# Altium project QuadCurrentLoopCape.PrjPCB
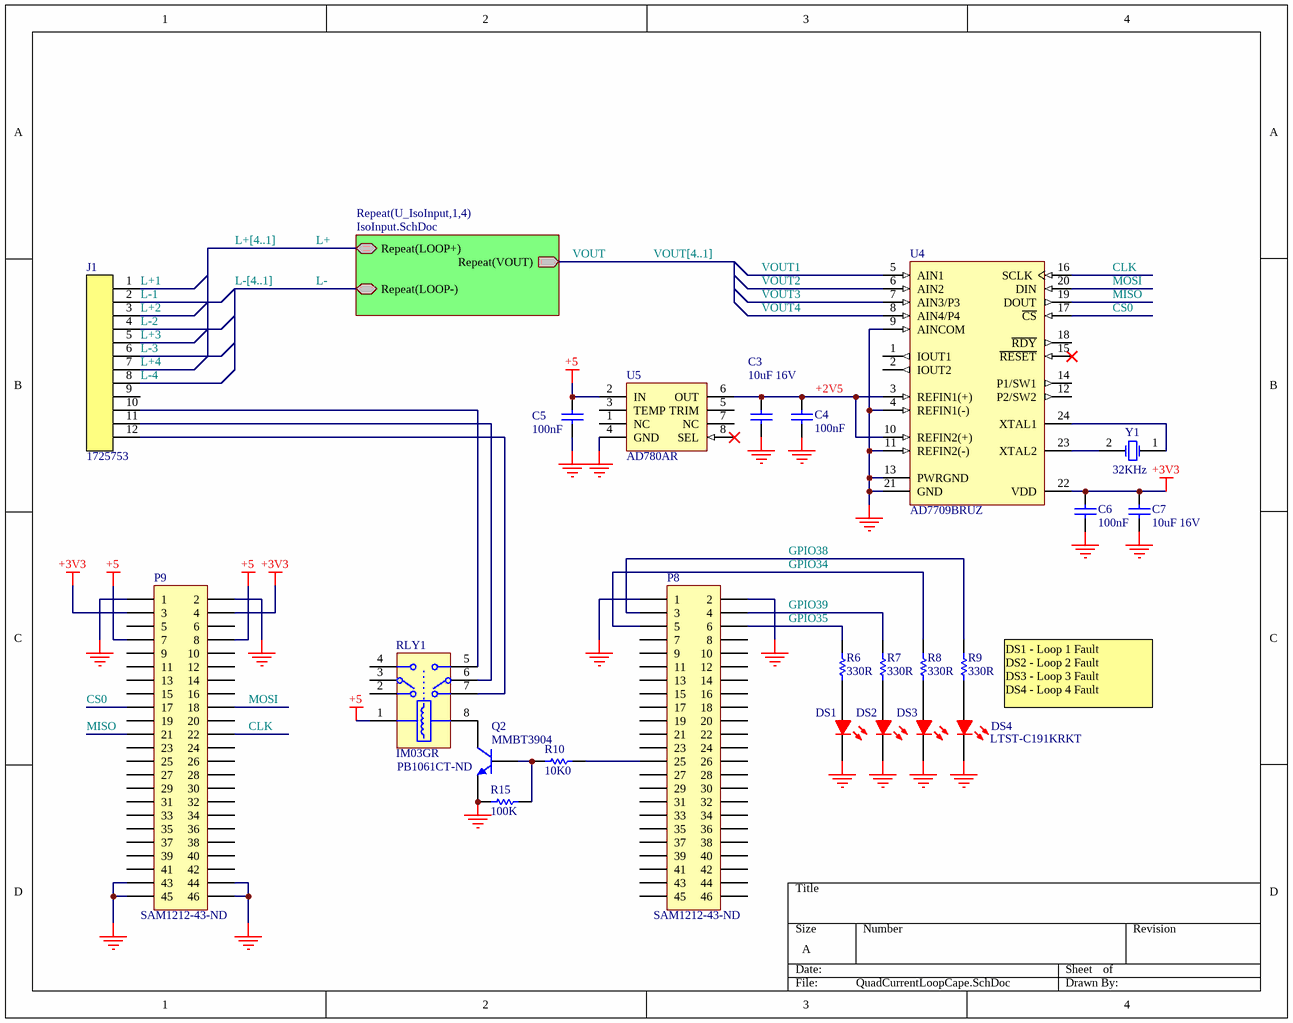
[diagram p0: QuadCurrentLoopCape.SchDoc]
2 sheets, 75 parts. Net scope: hierarchical (ports join the sheet entries above them; power ports are global).
Board file: QuadCurrentLoopCape.PcbDoc
Sheets:
  QuadCurrentLoopCape.SchDoc
    U_IsoInput1 = IsoInput.SchDoc
    U_IsoInput2 = IsoInput.SchDoc
    U_IsoInput3 = IsoInput.SchDoc
    U_IsoInput4 = IsoInput.SchDoc

## Sheet QuadCurrentLoopCape.SchDoc
size A

### Parts
C3  10uF 16V  [CAPC0805(2012)145_L]
C4  100nF  [CAPC0805(2012)100_M]
C5  100nF  [CAPC0805(2012)100_M]
C6  100nF  [CAPC0805(2012)100_M]
C7  10uF 16V  [CAPC0805(2012)145_L]
DS1  LTST-C191KRKT  [TOSH-0603LED_RED_V]  (value not drawn)
DS2  LTST-C191KRKT  [TOSH-0603LED_RED_V]  (value not drawn)
DS3  LTST-C191KRKT  [TOSH-0603LED_RED_V]  (value not drawn)
DS4  LTST-C191KRKT  [TOSH-0603LED_RED_V]
J1  1725753  [MPT0.5/12-2.54]
P8  Supplier Part Number 1: SAM1212-43-ND  [HDR2X23]  (hidden comment: Header 23X2)
P9  Supplier Part Number 1: SAM1212-43-ND  [HDR2X23]  (hidden comment: Header 23X2)
Q2  MMBT3904  [SOT23_N]
R6  value 330R  [RESC0805(2012)_L]  (hidden comment: 330R 1% 0805(2012))
R7  value 330R  [RESC0805(2012)_L]  (hidden comment: 330R 1% 0805(2012))
R8  value 330R  [RESC0805(2012)_L]  (hidden comment: 330R 1% 0805(2012))
R9  value 330R  [RESC0805(2012)_L]  (hidden comment: 330R 1% 0805(2012))
R10  10K0  [RESC0603(1608)_L]
R15  100K  [RESC0603(1608)_L]
RLY1  IM03GR  Supplier Part Number 1: PB1061CT-ND  [TECO-IM-8G-WING]
U4  AD7709BRUZ  [RU-24_L]
U5  AD780AR  [R-8C_L]
Y1  32KHz  [CMR200T]

### Sub-sheets
Repeat(U_IsoInput,1,4) = IsoInput.SchDoc: Repeat(LOOP+) (bidir), Repeat(LOOP-) (bidir), Repeat(VOUT) (out)

### Nets
+3V3: C6.2 C7.2 P9.3 P9.4 U4.22(VDD)
+5: C5.2 P9.7 P9.8 RLY1.1 U5.2(IN)
GND: C3.1 C4.1 C5.1 C6.1 C7.1 DS1.2(K) DS2.2(K) DS3.2(K) DS4.2(K) P8.1 P8.2 P9.1 P9.2 P9.43 P9.44 P9.45 P9.46 Q2.2(E) R15.2 U4.4(REFIN1(-)) U4.9(AINCOM) U4.11(REFIN2(-)) U4.13(PWRGND) U4.21(GND) U5.4(GND)
CLK: P9.22 U4.16(SCLK)
CS0: P9.17 U4.17(~{CS})
GPIO34: P8.5 R8.2
GPIO35: P8.6 R6.2
GPIO38: P8.3 R9.2
GPIO39: P8.4 R7.2
L+: sheet Repeat(U_IsoInput,1,4)/Repeat(LOOP+)
L+1: J1.1
L+2: J1.3
L+3: J1.5
L+4: J1.7
L-: sheet Repeat(U_IsoInput,1,4)/Repeat(LOOP-)
L-1: J1.2
L-2: J1.4
L-3: J1.6
L-4: J1.8
MISO: P9.21 U4.19(DOUT)
MOSI: P9.18 U4.20(DIN)
VOUT: sheet Repeat(U_IsoInput,1,4)/Repeat(VOUT)
VOUT1: U4.5(AIN1)
VOUT2: U4.6(AIN2)
VOUT3: U4.7(AIN3/P3)
VOUT4: U4.8(AIN4/P4)
NetC3_2: C3.2 C4.2 U4.3(REFIN1(+)) U4.10(REFIN2(+)) U5.6(OUT)
NetDS1_1: DS1.1(A) R6.1
NetDS2_1: DS2.1(A) R7.1
NetDS3_1: DS3.1(A) R8.1
NetDS4_1: DS4.1(A) R9.1
NetJ1_10: J1.10 RLY1.5
NetJ1_11: J1.11 RLY1.6
NetJ1_12: J1.12 RLY1.7
NetP8_25: P8.25 R10.2
NetQ2_1: Q2.1(B) R10.1 R15.1
NetQ2_3: Q2.3(C) RLY1.8
NetU4_23: U4.23(XTAL2) Y1.2(OSC2)
NetU4_24: U4.24(XTAL1) Y1.1(OSC1)

Not connected (* = marked no-connect by the designer): J1 9; P8 7 8 9 10 11 12 13 14 15 16 17 18 19 20 21 22 23 24 26 27 28 29 30 31 32 33 34 35 36 37 38 39 40 41 42 43 44 45 46; P9 5 6 9 10 11 12 13 14 15 16 19 20 23 24 25 26 27 28 29 30 31 32 33 34 35 36 37 38 39 40 41 42; RLY1 2 3 4; U4 1(IOUT1) 2(IOUT2) 12(P2/SW2) 14(P1/SW1) 15(~{RESET})* 18(~{RDY}); U5 1(NC) 3(TEMP) 5(TRIM) 7(NC) 8(SEL)*

### Buses and harness runs
bus L+[4..1]
bus L-[4..1]
bus VOUT[4..1]

### Notes on the sheet
- (near C4) +2V5
- DS1 - Loop 1 Fault
  DS2 - Loop 2 Fault
  DS3 - Loop 3 Fault
  DS4 - Loop 4 Fault

### Library data of the parts
C3 C7 = CMP-1036-04929-1: CAP 10uF 16V ±20% 0805 (2012 Metric) Thickness 1.45mm SMD; Case-EIA: 0805; Case-Metric: 2012; Value: 10uF 16V; Tolerance: ±20%; Rated Voltage: 16 V; Technology: SMT; Max Thickness: 1.45 mm; Supplier 1: Digi-Key; Supplier Part Number 1: 1276-2872-1-ND
C4-C6 = CMP-1036-04420-1: CAP 100nF 50V ±10% 0805 (2012 Metric) Thickness 1mm SMD; Case-EIA: 0805; Case-Metric: 2012; Rated Voltage: 50 V; Value: 100nF; Tolerance: ±10%; Max Thickness: 1 mm; Technology: SMT; Supplier 1: Digi-Key; Supplier Part Number 1: 399-1170-1-ND
DS1-DS4 = CMP-0444-00001-1: LED, Red 0603 (1608) 63mCd; Manufacturer: Toshiba; PartNumber: TLSU1008A(T04); Forward Current: 25 mA; Power Dissipation: 60 mW; Packing Type: Reel; Reverse Voltage: 4 V; Mounting Technology: Surface Mount; PackageDescription: 2-Pin SMT LED, 1.6 x 0.8 mm Pitch; ComponentLink1URL: http://www.toshiba-components.com/; ComponentLink1Description: Manufacturer URL; PackageReference: 0603LED_RED; ComponentLink2URL: http://www.semicon.toshiba.co.jp/info/docget.jsp?type=datasheet&lang=en&pid=TLSU1008A(T04); ComponentLink2Description: Datasheet; DatasheetVersion: Aug-08; Storage Temperature: -40 to 100 degC; Supplier 1: Digi-Key; Supplier Part Number 1: 160-1447-1-ND
J1 = Pheonix12: Supplier 1: Digi-Key; Supplier Part Number 1: 277-1283-ND
P8 P9 = Header 23X2: Header, 23-Pin, Dual Row; Supplier 1: Digi-Key
Q2 = MMBT3904: NPN Switching Transistor; AML Part Number: TRN-S0002; Published: 17-Sep-2003; LatestRevisionDate: 12-Dec-2006; LatestRevisionNote: IPC-7351 Footprint Added.; DatasheetVersion: 13-May-2002; PackageVersion: May-1999; PackageReference: SOT23; Publisher: Altium Limited; PackageDescription: 3-Pin SOT-23 Package 0.95 mm Pitch, 2.3 mm Lead Span; ComponentLink1Description: Manufacturer Link; ComponentLink1URL: http://www.semiconductors.philips.com/; ComponentLink2Description: Datasheet; ComponentLink2URL: http://www.semiconductors.philips.com/acrobat/datasheets/MMBT3904_4.pdf; Supplier 1: Digi-Key; Supplier Part Number 1: MMBT3904-FDICT-ND
R6-R9 = CMP-1013-00454-1: 330R 0.125W 1% 0805 (2012 Metric)  SMD; Case-EIA: 0805; Case-Metric: 2012; Power: 0.125 W; Tolerance: 1 %; Technology: SMT; Supplier 1: Digi-Key; Supplier Part Number 1: RHM330CHCT-ND
R10 = CMP-1012-00623-1: 10K 0.1W 1% 0603 (1608 Metric)  SMD; Value: 10000.00 Ohm; Case-EIA: 0603; Case-Metric: 1608; Power: 0.1 W; Tolerance: 1 %; Technology: SMT; Supplier Part Number 1: RHM330CHCT-ND; Supplier 1: Digi-Key
R15 = CMP-1012-00736-1: 100K 0.1W 1% 0603 (1608 Metric)  SMD; AML PArt Number: RES-S0242; Value: 100000.00 Ohm; Case-Metric: 1608; Case-EIA: 0603; Power: 0.1 W; Tolerance: 1 %; Technology: SMT; Supplier 1: Digi-Key; Supplier Part Number 1: 541-1825-1-ND
RLY1 = CMP-0439-00001-1: Low Power Consumption, High Dielectric, High Mechanical Shock Resistance, IM Relay; Manufacturer: TE Connectivity; Power Consumption: 140 mW; Contact Capacitance: 1 pF; Coil-contact Capacitance: 2 pF; Limiting Continuous Current: 2 A; ComponentLink1Description: Manufacturer URL; PackageReference: IM-8G-WING; Contact Material: PdRu +Au Covered; DatasheetVersion: Rev. 0411; ComponentLink2URL: http://www.te.com/commerce/DocumentDelivery/DDEController?Action=showdoc&DocId=Specification+Or+Standard%7F108-98001%7FS%7Fpdf%7FEnglish%7FENG_SS_108-98001_S.pdf%7F1-1462037-4; ComponentLink2Description: Datasheet; Mounting Technology: Surface Mount; Ambient Temperature: -40 to 85 degC; PartNumber: IM03GR; ComponentLink1URL: http://www.te.com/; PackageDescription: 8-Pin Relay, 10 x 6 mm Body, 0.95 mm Pitch; Supplier 1: Digi-Key
U4 = CMP-0313-01986-2: Quad 16-Bit Sigma-Delta Analog-to-Digital Converter with Serial, SPI Interface, 105SPS, -40 to +85 degC, RU-24, Pb-Free, Tube; Manufacturer: Analog Devices; Generic Part Number: AD7709; Interface: Ser, SPI; Resolution (Bits): 16; Throughput Rate (SPS): 105; Channels: 4; ComponentLink4Description: Product URL; Packing: Tube; DatasheetVersion: Rev.A; ComponentLink3Description: Package Specification; PackageReference: RU-24; PackageDescription: 24-Lead Thin Shrink Small Outline Package [TSSOP]; RoHS: Y; Code_JEDEC: MO-153-AD; ComponentLink1Description: Manufacturer URL; PackageVersion: 2002; ComponentLink2URL: http://www.analog.com/static/imported-files/data_sheets/AD7709.pdf; ComponentLink4URL: http://www.analog.com/en/analog-to-digital-converters/ad-converters/ad7709/products/product.html; PartNumber: AD7709BRUZ; ComponentLink2Description: Datasheet; ComponentLink3URL: http://www.analog.com/static/imported-files/packages/380523655245964505593671154107510036154RU24.pdf; Mounting Technology: Surface Mount; ComponentLink1URL: http://www.analog.com/en/index.html; Supplier 1: Digi-Key; Supplier Part Number 1: AD7709BRUZ-ND
U5 = AD780AR: 2.5V/3.0V Ultrahigh Precision Bandgap Voltage Reference; Note: Pins 1 and 7 are not connected; Published: 8-Jun-2000; LatestRevisionDate: 13-Apr-2006; LatestRevisionNote: IPC-7351 Footprint Added.; DatasheetVersion: REV. A; PackageVersion: revC; PackageReference: R-8C; Publisher: Altium Limited; PackageDescription: 8-Pin Small Outline Integrated Circuit 1.27 mm Pitch; Code_IPC: SOIC127P600-8; ComponentLink1Description: Manufacturer Link; ComponentLink1URL: http://www.analog.com/en/prod/0,,769_838_AD780%2C00.html; ComponentLink2Description: Datasheet; ComponentLink2URL: http://www.analog.com/UploadedFiles/Data_Sheets/87683462AD780_e.pdf; Supplier 1: Digi-Key; Supplier Part Number 1: AD780ARZ-ND
Y1 = XTAL: Crystal Oscillator; Published: 8-Jun-2000; LatestRevisionDate: 17-Jul-2002; LatestRevisionNote: Re-released for DXP Platform.; PackageReference: R38; Publisher: Altium Limited; PackageDescription: Crystal, Thru-Hole; 2 Leads; Body 3.1 x 8.2 mm (Dia.xH); Supplier 1: Digi-Key; Supplier Part Number 1: 535-9033-1-ND

## Sheet IsoInput.SchDoc
size A
Used 4 times, as channels U_IsoInput1, U_IsoInput2, U_IsoInput3, U_IsoInput4. Parts and nets are listed once, with the designators drawn on the sheet.
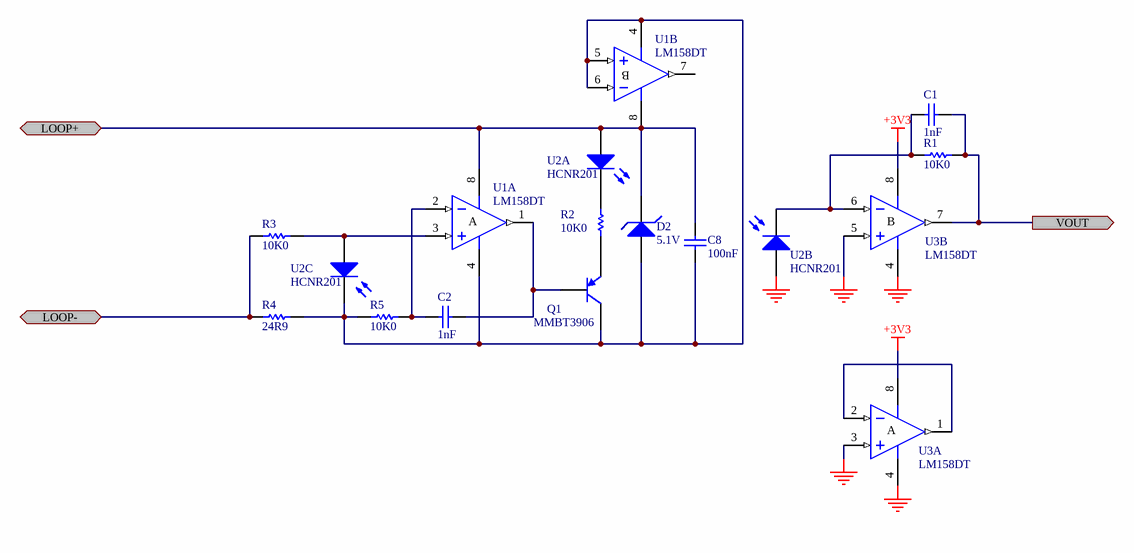
[diagram p1: IsoInput.SchDoc]

### Parts
C1  1nF  [CAPC0805(2012)100_L]
C2  1nF  [CAPC0805(2012)100_L]
C8  100nF  [CAPC0805(2012)100_L]
D2  5.1V  [DIOD-S1M-13-F-SMA-2_V]
Q1  MMBT3906  [SOT23_N]
R1  10K0  [RESC0805(2012)_L]
R2  10K0  [RESC0805(2012)_L]
R3  10K0  [RESC0805(2012)_L]
R4  24R9  [RESC0805(2012)_L]
R5  10K0  [RESC0805(2012)_L]
U1  LM158DT  [SO8_N]  (parts A,B of 2)
U2  HCNR201  [DIP-8W]  (parts A,B,C of 3)
U3  LM158DT  [SO8_N]  (parts A,B of 2)

### Ports
LOOP+ (bidir), LOOP- (bidir), VOUT (out)

### Nets
+3V3: U3.8(V+)
GND: U2.4(PD1A) U3.3(IN+) U3.4(V-) U3.5(IN+)
LOOP+: C8.2 D2.2(K) U1.8(V+) U2.2(A) ; port LOOP+
LOOP-: R3.2 R4.1 ; port LOOP-
VOUT: C1.2 R1.1 U3.7(OUT) ; port VOUT
NetC1_1: C1.1 R1.2 U2.3(PD1K) U3.6(IN-)
NetC2_1: C2.1 R5.1 U1.2(IN-)
NetC2_2: C2.2 Q1.1(B) U1.1(OUT)
NetC8_1: C8.1 D2.1(A) Q1.3(C) R4.2 R5.2 U1.4(V-) U1.5(IN+) U1.6(IN-) U2.6(PD2K)
NetQ1_2: Q1.2(E) R2.1
NetR2_2: R2.2 U2.1(K)
NetR3_1: R3.1 U1.3(IN+) U2.5(PD2A)
NetU3_1: U3.1(OUT) U3.2(IN-)

Not connected (* = marked no-connect by the designer): U1 7(OUT)

### Channels
U_IsoInput1: designators end in 1; ports LOOP+=L+1 LOOP-=L-1 VOUT=VOUT1
U_IsoInput2: designators end in 2; ports LOOP+=L+2 LOOP-=L-2 VOUT=VOUT2
U_IsoInput3: designators end in 3; ports LOOP+=L+3 LOOP-=L-3 VOUT=VOUT3
U_IsoInput4: designators end in 4; ports LOOP+=L+4 LOOP-=L-4 VOUT=VOUT4

### Notes on the sheet
- (in symbol LM158AD, part A) A
- (in symbol LM158AD, part B) B

### Library data of the parts
C1 C2 = CMP-1036-02980-1: CAP 1nF 50V ±10% 0805 (2012 Metric) Thickness 1mm SMD; Case-Metric: 2012; Case-EIA: 0805; Value: 1nF; Technology: SMT; Tolerance: ±10%; Max Thickness: 1 mm; Rated Voltage: 50 V; Supplier 1: Digi-Key; Supplier Part Number 1: 399-1147-1-ND
C8 = CMP-1036-04420-1: as C4 on sheet QuadCurrentLoopCape; Rated Voltage: 50 V; Value: 100nF; Tolerance: ±10%; Max Thickness: 1 mm; Technology: SMT; Supplier 1: Digi-Key; Supplier Part Number 1: 399-1170-1-ND
D2 = CMP-0639-00001-1: Surface Mount Glass Passivated Rectifier, 1000V, 1 A, -65 to 5.1V Zener Diode SMA; Manufacturer: Diodes Inc; PartNumber: S1M-13-F; Maximum Reverse Current IR (uA): 5; Maximum Peak Forward Surge Current IFSM (A): 30; Maximum Average Rectified Current IO (A): 1; Peak Repetitive Reverse Voltage VRRM (V): 1000; Total Capacitance CT (pF): 10; Forward Voltage Drop VF (V): 1.1; Packing: Tape and Reel; ComponentLink1URL: http://www.diodes.com/; Operating Temperature Range: -65 to 150 degC; ComponentLink3URL: http://diodes.com/datasheets/ds16003.pdf; ComponentLink3Description: Package Specification; PackageDescription: 2-Pin SMD, Body 4.3 x 2.605 mm, Height 2.3 mm; Mounting Technology: Surface Mount; ComponentLink1Description: Manufacturer URL; PackageReference: S1M-13-F-SMA-2; ComponentLink2URL: http://diodes.com/datasheets/ds16003.pdf; ComponentLink2Description: Datasheet; RoHS: TRUE; DatasheetVersion: Rev. 22 - 2; PackageVersion: Rev. 22 - 2; Supplier 1: Digi-Key; Supplier Part Number 1: SMAZ5V1-TPMSCT-ND
Q1 = MMBT3906: PNP Switching Transistor; Published: 17-Sep-2003; LatestRevisionDate: 12-Dec-2006; LatestRevisionNote: IPC-7351 Footprint Added.; DatasheetVersion: 11-Apr-2000; PackageVersion: May-1999; PackageReference: SOT23; Publisher: Altium Limited; PackageDescription: 3-Pin SOT-23 Package 0.95 mm Pitch, 2.3 mm Lead Span; ComponentLink1Description: Manufacturer Link; ComponentLink1URL: http://www.semiconductors.philips.com/; ComponentLink2Description: Datasheet; ComponentLink2URL: http://www.semiconductors.philips.com/acrobat/datasheets/MMBT3906_2.pdf; Supplier 1: Digi-Key; Supplier Part Number 1: MMBT3906-FDICT-ND
R1-R3 R5 = CMP-1013-00623-1: 10K 0.125W 1% 0805 (2012 Metric)  SMD; Case-Metric: 2012; Case-EIA: 0805; Value: 10K0; Tolerance: 1 %; Power: 0.125 W; Technology: SMT; Supplier 1: Digi-Key; Supplier Part Number 1: RMCF0805FT10K0CT-ND
R4 = CMP-1013-00327-1: 24R9 0.125W 1% 0805 (2012 Metric)  SMD; Case-Metric: 2012; Case-EIA: 0805; Power: 0.125 W; Technology: SMT; Tolerance: 1 %; Value: 24R9; Supplier 1: Digi-Key; Supplier Part Number 1: RHM24.9CHCT-ND
U1 U3 = LM158AD: Low-Power Dual Operational Amplifier; Published: 24-Aug-2001; LatestRevisionDate: 13-Apr-2006; LatestRevisionNote: IPC-7351 Footprint Added.; DatasheetVersion: Jun-1998; PackageVersion: Dec-2002; PackageReference: SO8; Publisher: Altium Limited; PackageDescription: 8-Pin Small Outline Integrated Circuit 1.27 mm Pitch; Code_JEDEC: MS-012-AA; Code_IPC: SOIC127P600-8; ComponentLink1Description: Manufacturer Link; ComponentLink1URL: http://www.st.com/; ComponentLink2Description: Datasheet; ComponentLink2URL: http://www.st.com/stonline/products/literature/ds/2163/lm358.pdf; Supplier 1: Digi-Key; Supplier Part Number 1: 497-6990-1-ND
U2 = HCNR201: Analog Optocoupler; Supplier 1: Digi-Key; Supplier Part Number 1: 516-1523-5-ND

## Nets that join several sheets
+3V3: QuadCurrentLoopCape (5 pins), U_IsoInput1 (U31.8), U_IsoInput2 (U32.8), U_IsoInput3 (U33.8), U_IsoInput4 (U34.8)
GND: QuadCurrentLoopCape (25 pins), U_IsoInput1 (U21.4 U31.3 U31.4 U31.5), U_IsoInput2 (U22.4 U32.3 U32.4 U32.5), U_IsoInput3 (U23.4 U33.3 U33.4 U33.5), U_IsoInput4 (U24.4 U34.3 U34.4 U34.5)
L+1: QuadCurrentLoopCape (J1.1), U_IsoInput1 (C81.2 D21.2 U11.8 U21.2)
L+2: QuadCurrentLoopCape (J1.3), U_IsoInput2 (C82.2 D22.2 U12.8 U22.2)
L+3: QuadCurrentLoopCape (J1.5), U_IsoInput3 (C83.2 D23.2 U13.8 U23.2)
L+4: QuadCurrentLoopCape (J1.7), U_IsoInput4 (C84.2 D24.2 U14.8 U24.2)
L-1: QuadCurrentLoopCape (J1.2), U_IsoInput1 (R31.2 R41.1)
L-2: QuadCurrentLoopCape (J1.4), U_IsoInput2 (R32.2 R42.1)
L-3: QuadCurrentLoopCape (J1.6), U_IsoInput3 (R33.2 R43.1)
L-4: QuadCurrentLoopCape (J1.8), U_IsoInput4 (R34.2 R44.1)
VOUT1: QuadCurrentLoopCape (U4.5), U_IsoInput1 (C11.2 R11.1 U31.7)
VOUT2: QuadCurrentLoopCape (U4.6), U_IsoInput2 (C12.2 R12.1 U32.7)
VOUT3: QuadCurrentLoopCape (U4.7), U_IsoInput3 (C13.2 R13.1 U33.7)
VOUT4: QuadCurrentLoopCape (U4.8), U_IsoInput4 (C14.2 R14.1 U34.7)